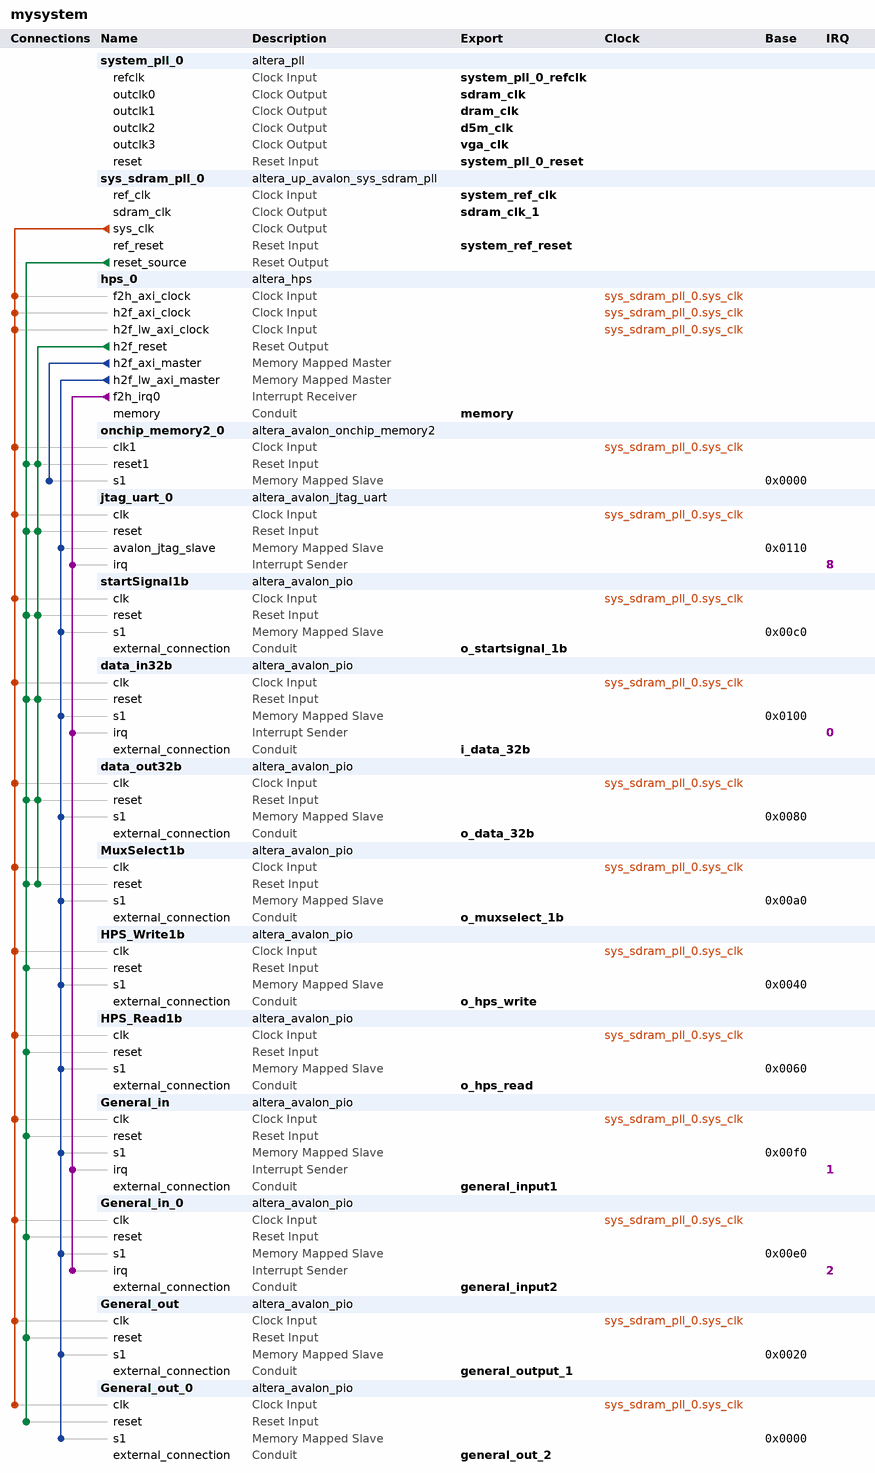
[diagram p0: system contents]
# Platform Designer (Qsys) system mysystem, Cyclone V 5CSEMA5F31C6
# Parameters at their usual value, and those the tool derives, are not listed.
package require -exact qsys 13.1
create_system mysystem
set_project_property DEVICE_FAMILY {Cyclone V}
set_project_property DEVICE 5CSEMA5F31C6

add_instance system_pll_0 altera_pll 13.1
set_instance_parameter_value system_pll_0 gui_device_speed_grade 2
set_instance_parameter_value system_pll_0 gui_pll_mode {Integer-N PLL}
set_instance_parameter_value system_pll_0 gui_reference_clock_frequency 50.0
set_instance_parameter_value system_pll_0 gui_operation_mode direct
set_instance_parameter_value system_pll_0 gui_use_locked false
set_instance_parameter_value system_pll_0 gui_number_of_clocks 4
set_instance_parameter_value system_pll_0 gui_output_clock_frequency0 100.0
set_instance_parameter_value system_pll_0 gui_output_clock_frequency1 100.0
set_instance_parameter_value system_pll_0 gui_ps_units1 degrees
set_instance_parameter_value system_pll_0 gui_phase_shift_deg1 -90.0
set_instance_parameter_value system_pll_0 gui_output_clock_frequency2 25.0
set_instance_parameter_value system_pll_0 gui_output_clock_frequency3 25.0

add_instance sys_sdram_pll_0 altera_up_avalon_sys_sdram_pll 13.1
set_instance_parameter_value sys_sdram_pll_0 gui_refclk 50.0
set_instance_parameter_value sys_sdram_pll_0 gui_outclk 100.0
set_instance_parameter_value sys_sdram_pll_0 CV_boards DE1-SoC

add_instance hps_0 altera_hps 13.1
set_instance_parameter_value hps_0 MEM_VENDOR JEDEC
set_instance_parameter_value hps_0 MEM_CLK_FREQ_MAX 400.0
set_instance_parameter_value hps_0 MEM_ROW_ADDR_WIDTH 12
set_instance_parameter_value hps_0 MEM_COL_ADDR_WIDTH 8
set_instance_parameter_value hps_0 MEM_DQ_WIDTH 8
set_instance_parameter_value hps_0 MEM_BANKADDR_WIDTH 3
set_instance_parameter_value hps_0 MEM_DRV_STR RZQ/6
set_instance_parameter_value hps_0 MEM_RTT_NOM RZQ/6
set_instance_parameter_value hps_0 MEM_RTT_WR {Dynamic ODT off}
set_instance_parameter_value hps_0 MEM_WTCL 6
set_instance_parameter_value hps_0 MEM_TCL 7
set_instance_parameter_value hps_0 TIMING_TIS 175
set_instance_parameter_value hps_0 TIMING_TIH 250
set_instance_parameter_value hps_0 TIMING_TDS 50
set_instance_parameter_value hps_0 TIMING_TDH 125
set_instance_parameter_value hps_0 TIMING_TDQSQ 120
set_instance_parameter_value hps_0 TIMING_TDQSCK 400
set_instance_parameter_value hps_0 TIMING_TQSH 0.38
set_instance_parameter_value hps_0 MEM_TINIT_US 499
set_instance_parameter_value hps_0 MEM_TMRD_CK 3
set_instance_parameter_value hps_0 MEM_TRAS_NS 40.0
set_instance_parameter_value hps_0 MEM_TRCD_NS 15.0
set_instance_parameter_value hps_0 MEM_TRP_NS 15.0
set_instance_parameter_value hps_0 MEM_TREFI_US 7.0
set_instance_parameter_value hps_0 MEM_TRFC_NS 75.0
set_instance_parameter_value hps_0 MEM_TWTR 2
set_instance_parameter_value hps_0 MEM_TFAW_NS 37.5
set_instance_parameter_value hps_0 REF_CLK_FREQ 125.0
set_instance_parameter_value hps_0 DEFAULT_FAST_SIM_MODEL true
set_instance_parameter_value hps_0 TIMING_BOARD_MAX_CK_DELAY 0.6
set_instance_parameter_value hps_0 TIMING_BOARD_MAX_DQS_DELAY 0.6
set_instance_parameter_value hps_0 TIMING_BOARD_SKEW_CKDQS_DIMM_MIN -0.01
set_instance_parameter_value hps_0 TIMING_BOARD_SKEW_CKDQS_DIMM_MAX 0.01
set_instance_parameter_value hps_0 TIMING_BOARD_SKEW_WITHIN_DQS 0.02
set_instance_parameter_value hps_0 TIMING_BOARD_SKEW_BETWEEN_DQS 0.02
set_instance_parameter_value hps_0 TIMING_BOARD_DQ_TO_DQS_SKEW 0.0
set_instance_parameter_value hps_0 TIMING_BOARD_AC_SKEW 0.02
set_instance_parameter_value hps_0 TIMING_BOARD_AC_TO_CK_SKEW 0.0
set_instance_parameter_value hps_0 MEM_CLK_FREQ 300.0
set_instance_parameter_value hps_0 HPS_PROTOCOL DDR3
set_instance_parameter_value hps_0 STM_Enable false
set_instance_parameter_value hps_0 F2S_Width 2
set_instance_parameter_value hps_0 S2F_Width 3
set_instance_parameter_value hps_0 LWH2F_Enable true
set_instance_parameter_value hps_0 F2SCLK_DBGRST_Enable false
set_instance_parameter_value hps_0 F2SCLK_WARMRST_Enable false
set_instance_parameter_value hps_0 F2SCLK_COLDRST_Enable false
set_instance_parameter_value hps_0 F2SINTERRUPT_Enable true
set_instance_parameter_value hps_0 EMAC1_PinMuxing Unused
set_instance_parameter_value hps_0 EMAC1_Mode N/A
set_instance_parameter_value hps_0 QSPI_PinMuxing Unused
set_instance_parameter_value hps_0 QSPI_Mode N/A
set_instance_parameter_value hps_0 SDIO_PinMuxing Unused
set_instance_parameter_value hps_0 SDIO_Mode N/A
set_instance_parameter_value hps_0 USB1_PinMuxing Unused
set_instance_parameter_value hps_0 USB1_Mode N/A
set_instance_parameter_value hps_0 SPIM1_PinMuxing Unused
set_instance_parameter_value hps_0 SPIM1_Mode N/A
set_instance_parameter_value hps_0 UART0_PinMuxing Unused
set_instance_parameter_value hps_0 UART0_Mode N/A
set_instance_parameter_value hps_0 I2C0_PinMuxing Unused
set_instance_parameter_value hps_0 I2C0_Mode N/A
set_instance_parameter_value hps_0 I2C1_PinMuxing Unused
set_instance_parameter_value hps_0 I2C1_Mode N/A
set_instance_parameter_value hps_0 S2FCLK_USER1CLK_FREQ 100
set_instance_parameter_value hps_0 FPGA_PERIPHERAL_OUTPUT_CLOCK_FREQ_EMAC0_MD_CLK 100
set_instance_parameter_value hps_0 FPGA_PERIPHERAL_OUTPUT_CLOCK_FREQ_EMAC0_GTX_CLK 100
set_instance_parameter_value hps_0 FPGA_PERIPHERAL_OUTPUT_CLOCK_FREQ_EMAC1_MD_CLK 100
set_instance_parameter_value hps_0 FPGA_PERIPHERAL_OUTPUT_CLOCK_FREQ_EMAC1_GTX_CLK 100

add_instance onchip_memory2_0 altera_avalon_onchip_memory2 13.1
set_instance_parameter_value onchip_memory2_0 dataWidth 32
set_instance_parameter_value onchip_memory2_0 dualPort false
set_instance_parameter_value onchip_memory2_0 initMemContent true
set_instance_parameter_value onchip_memory2_0 initializationFileName onchip_mem.hex
set_instance_parameter_value onchip_memory2_0 memorySize 16384

add_instance jtag_uart_0 altera_avalon_jtag_uart 13.1
set_instance_parameter_value jtag_uart_0 simInteractiveOptions NO_INTERACTIVE_WINDOWS

add_instance startSignal1b altera_avalon_pio 13.1
set_instance_parameter_value startSignal1b bitModifyingOutReg true
set_instance_parameter_value startSignal1b direction Output
set_instance_parameter_value startSignal1b width 1

add_instance data_in32b altera_avalon_pio 13.1
set_instance_parameter_value data_in32b bitClearingEdgeCapReg true
set_instance_parameter_value data_in32b captureEdge true
set_instance_parameter_value data_in32b direction Input
set_instance_parameter_value data_in32b edgeType FALLING
set_instance_parameter_value data_in32b generateIRQ true
set_instance_parameter_value data_in32b irqType EDGE
set_instance_parameter_value data_in32b simDoTestBenchWiring true
set_instance_parameter_value data_in32b width 32

add_instance data_out32b altera_avalon_pio 13.1
set_instance_parameter_value data_out32b bitClearingEdgeCapReg true
set_instance_parameter_value data_out32b bitModifyingOutReg true
set_instance_parameter_value data_out32b captureEdge true
set_instance_parameter_value data_out32b direction Output
set_instance_parameter_value data_out32b edgeType FALLING
set_instance_parameter_value data_out32b generateIRQ true
set_instance_parameter_value data_out32b irqType EDGE
set_instance_parameter_value data_out32b simDoTestBenchWiring true
set_instance_parameter_value data_out32b width 32

add_instance MuxSelect1b altera_avalon_pio 13.1
set_instance_parameter_value MuxSelect1b bitClearingEdgeCapReg true
set_instance_parameter_value MuxSelect1b bitModifyingOutReg true
set_instance_parameter_value MuxSelect1b captureEdge true
set_instance_parameter_value MuxSelect1b direction Output
set_instance_parameter_value MuxSelect1b edgeType FALLING
set_instance_parameter_value MuxSelect1b generateIRQ true
set_instance_parameter_value MuxSelect1b irqType EDGE
set_instance_parameter_value MuxSelect1b simDoTestBenchWiring true
set_instance_parameter_value MuxSelect1b width 1

add_instance HPS_Write1b altera_avalon_pio 13.1
set_instance_parameter_value HPS_Write1b bitModifyingOutReg true
set_instance_parameter_value HPS_Write1b direction Output
set_instance_parameter_value HPS_Write1b width 1

add_instance HPS_Read1b altera_avalon_pio 13.1
set_instance_parameter_value HPS_Read1b bitModifyingOutReg true
set_instance_parameter_value HPS_Read1b direction Output
set_instance_parameter_value HPS_Read1b width 1

add_instance General_in altera_avalon_pio 13.1
set_instance_parameter_value General_in bitClearingEdgeCapReg true
set_instance_parameter_value General_in captureEdge true
set_instance_parameter_value General_in direction Input
set_instance_parameter_value General_in edgeType FALLING
set_instance_parameter_value General_in generateIRQ true
set_instance_parameter_value General_in irqType EDGE
set_instance_parameter_value General_in simDoTestBenchWiring true
set_instance_parameter_value General_in width 32

add_instance General_in_0 altera_avalon_pio 13.1
set_instance_parameter_value General_in_0 bitClearingEdgeCapReg true
set_instance_parameter_value General_in_0 captureEdge true
set_instance_parameter_value General_in_0 direction Input
set_instance_parameter_value General_in_0 edgeType FALLING
set_instance_parameter_value General_in_0 generateIRQ true
set_instance_parameter_value General_in_0 irqType EDGE
set_instance_parameter_value General_in_0 simDoTestBenchWiring true
set_instance_parameter_value General_in_0 width 32

add_instance General_out altera_avalon_pio 13.1
set_instance_parameter_value General_out bitClearingEdgeCapReg true
set_instance_parameter_value General_out bitModifyingOutReg true
set_instance_parameter_value General_out captureEdge true
set_instance_parameter_value General_out direction Output
set_instance_parameter_value General_out edgeType FALLING
set_instance_parameter_value General_out generateIRQ true
set_instance_parameter_value General_out irqType EDGE
set_instance_parameter_value General_out simDoTestBenchWiring true
set_instance_parameter_value General_out width 32

add_instance General_out_0 altera_avalon_pio 13.1
set_instance_parameter_value General_out_0 bitClearingEdgeCapReg true
set_instance_parameter_value General_out_0 bitModifyingOutReg true
set_instance_parameter_value General_out_0 captureEdge true
set_instance_parameter_value General_out_0 direction Output
set_instance_parameter_value General_out_0 edgeType FALLING
set_instance_parameter_value General_out_0 generateIRQ true
set_instance_parameter_value General_out_0 irqType EDGE
set_instance_parameter_value General_out_0 simDoTestBenchWiring true
set_instance_parameter_value General_out_0 width 32

# connections
add_connection sys_sdram_pll_0.sys_clk data_in32b.clk clock
add_connection sys_sdram_pll_0.sys_clk data_out32b.clk clock
add_connection sys_sdram_pll_0.sys_clk General_in.clk clock
add_connection sys_sdram_pll_0.sys_clk General_in_0.clk clock
add_connection sys_sdram_pll_0.sys_clk General_out.clk clock
add_connection sys_sdram_pll_0.sys_clk General_out_0.clk clock
add_connection sys_sdram_pll_0.sys_clk hps_0.f2h_axi_clock clock
add_connection sys_sdram_pll_0.sys_clk hps_0.h2f_axi_clock clock
add_connection sys_sdram_pll_0.sys_clk hps_0.h2f_lw_axi_clock clock
add_connection sys_sdram_pll_0.sys_clk HPS_Read1b.clk clock
add_connection sys_sdram_pll_0.sys_clk HPS_Write1b.clk clock
add_connection sys_sdram_pll_0.sys_clk jtag_uart_0.clk clock
add_connection sys_sdram_pll_0.sys_clk MuxSelect1b.clk clock
add_connection sys_sdram_pll_0.sys_clk onchip_memory2_0.clk1 clock
add_connection sys_sdram_pll_0.sys_clk startSignal1b.clk clock
add_connection hps_0.h2f_reset data_in32b.reset reset
add_connection hps_0.h2f_reset data_out32b.reset reset
add_connection hps_0.h2f_reset jtag_uart_0.reset reset
add_connection hps_0.h2f_reset MuxSelect1b.reset reset
add_connection hps_0.h2f_reset onchip_memory2_0.reset1 reset
add_connection hps_0.h2f_reset startSignal1b.reset reset
add_connection sys_sdram_pll_0.reset_source data_in32b.reset reset
add_connection sys_sdram_pll_0.reset_source data_out32b.reset reset
add_connection sys_sdram_pll_0.reset_source General_in.reset reset
add_connection sys_sdram_pll_0.reset_source General_in_0.reset reset
add_connection sys_sdram_pll_0.reset_source General_out.reset reset
add_connection sys_sdram_pll_0.reset_source General_out_0.reset reset
add_connection sys_sdram_pll_0.reset_source HPS_Read1b.reset reset
add_connection sys_sdram_pll_0.reset_source HPS_Write1b.reset reset
add_connection sys_sdram_pll_0.reset_source jtag_uart_0.reset reset
add_connection sys_sdram_pll_0.reset_source MuxSelect1b.reset reset
add_connection sys_sdram_pll_0.reset_source onchip_memory2_0.reset1 reset
add_connection sys_sdram_pll_0.reset_source startSignal1b.reset reset
add_connection hps_0.h2f_axi_master onchip_memory2_0.s1 avalon
set_connection_parameter_value hps_0.h2f_axi_master/onchip_memory2_0.s1 baseAddress 0x0000
add_connection hps_0.h2f_lw_axi_master data_in32b.s1 avalon
set_connection_parameter_value hps_0.h2f_lw_axi_master/data_in32b.s1 baseAddress 0x0100
add_connection hps_0.h2f_lw_axi_master data_out32b.s1 avalon
set_connection_parameter_value hps_0.h2f_lw_axi_master/data_out32b.s1 baseAddress 0x0080
add_connection hps_0.h2f_lw_axi_master General_in.s1 avalon
set_connection_parameter_value hps_0.h2f_lw_axi_master/General_in.s1 baseAddress 0x00f0
add_connection hps_0.h2f_lw_axi_master General_in_0.s1 avalon
set_connection_parameter_value hps_0.h2f_lw_axi_master/General_in_0.s1 baseAddress 0x00e0
add_connection hps_0.h2f_lw_axi_master General_out.s1 avalon
set_connection_parameter_value hps_0.h2f_lw_axi_master/General_out.s1 baseAddress 0x0020
add_connection hps_0.h2f_lw_axi_master General_out_0.s1 avalon
set_connection_parameter_value hps_0.h2f_lw_axi_master/General_out_0.s1 baseAddress 0x0000
add_connection hps_0.h2f_lw_axi_master HPS_Read1b.s1 avalon
set_connection_parameter_value hps_0.h2f_lw_axi_master/HPS_Read1b.s1 baseAddress 0x0060
add_connection hps_0.h2f_lw_axi_master HPS_Write1b.s1 avalon
set_connection_parameter_value hps_0.h2f_lw_axi_master/HPS_Write1b.s1 baseAddress 0x0040
add_connection hps_0.h2f_lw_axi_master jtag_uart_0.avalon_jtag_slave avalon
set_connection_parameter_value hps_0.h2f_lw_axi_master/jtag_uart_0.avalon_jtag_slave baseAddress 0x0110
add_connection hps_0.h2f_lw_axi_master MuxSelect1b.s1 avalon
set_connection_parameter_value hps_0.h2f_lw_axi_master/MuxSelect1b.s1 baseAddress 0x00a0
add_connection hps_0.h2f_lw_axi_master startSignal1b.s1 avalon
set_connection_parameter_value hps_0.h2f_lw_axi_master/startSignal1b.s1 baseAddress 0x00c0
add_connection hps_0.f2h_irq0 data_in32b.irq interrupt
set_connection_parameter_value hps_0.f2h_irq0/data_in32b.irq irqNumber 0
add_connection hps_0.f2h_irq0 General_in.irq interrupt
set_connection_parameter_value hps_0.f2h_irq0/General_in.irq irqNumber 1
add_connection hps_0.f2h_irq0 General_in_0.irq interrupt
set_connection_parameter_value hps_0.f2h_irq0/General_in_0.irq irqNumber 2
add_connection hps_0.f2h_irq0 jtag_uart_0.irq interrupt
set_connection_parameter_value hps_0.f2h_irq0/jtag_uart_0.irq irqNumber 8

# exported interfaces
add_interface sdram_clk clock source
set_interface_property sdram_clk EXPORT_OF system_pll_0.outclk0
add_interface dram_clk clock source
set_interface_property dram_clk EXPORT_OF system_pll_0.outclk1
add_interface d5m_clk clock source
set_interface_property d5m_clk EXPORT_OF system_pll_0.outclk2
add_interface vga_clk clock source
set_interface_property vga_clk EXPORT_OF system_pll_0.outclk3
add_interface system_pll_0_refclk clock sink
set_interface_property system_pll_0_refclk EXPORT_OF system_pll_0.refclk
add_interface system_pll_0_reset reset sink
set_interface_property system_pll_0_reset EXPORT_OF system_pll_0.reset
add_interface memory conduit end
set_interface_property memory EXPORT_OF hps_0.memory
add_interface o_startsignal_1b conduit end
set_interface_property o_startsignal_1b EXPORT_OF startSignal1b.external_connection
add_interface system_ref_clk clock sink
set_interface_property system_ref_clk EXPORT_OF sys_sdram_pll_0.ref_clk
add_interface sdram_clk_1 clock source
set_interface_property sdram_clk_1 EXPORT_OF sys_sdram_pll_0.sdram_clk
add_interface system_ref_reset reset sink
set_interface_property system_ref_reset EXPORT_OF sys_sdram_pll_0.ref_reset
add_interface i_data_32b conduit end
set_interface_property i_data_32b EXPORT_OF data_in32b.external_connection
add_interface o_data_32b conduit end
set_interface_property o_data_32b EXPORT_OF data_out32b.external_connection
add_interface o_muxselect_1b conduit end
set_interface_property o_muxselect_1b EXPORT_OF MuxSelect1b.external_connection
add_interface o_hps_write conduit end
set_interface_property o_hps_write EXPORT_OF HPS_Write1b.external_connection
add_interface o_hps_read conduit end
set_interface_property o_hps_read EXPORT_OF HPS_Read1b.external_connection
add_interface general_input1 conduit end
set_interface_property general_input1 EXPORT_OF General_in.external_connection
add_interface general_output_1 conduit end
set_interface_property general_output_1 EXPORT_OF General_out.external_connection
add_interface general_input2 conduit end
set_interface_property general_input2 EXPORT_OF General_in_0.external_connection
add_interface general_out_2 conduit end
set_interface_property general_out_2 EXPORT_OF General_out_0.external_connection

set_interconnect_requirement {$system} qsys_mm.clockCrossingAdapter HANDSHAKE
set_interconnect_requirement {$system} qsys_mm.maxAdditionalLatency 1
set_interconnect_requirement {$system} qsys_mm.insertDefaultSlave false

save_system mysystem.qsys
